# Altium schematic sheet 243-5xx_Pi-CAN-PWM.SchDoc: CAN Controller + Transceiver and Ctrl PWM
size Letter; ApprovedBy: k.cotton; Engineer: K.Cotton; Organization: Cegep Limoilou; Address1: 1300, 8e Avenue; Address2: Québec, QC; Address3: Canada; Address4: G1J 5L5; SheetNumber: 1; SheetTotal: 4
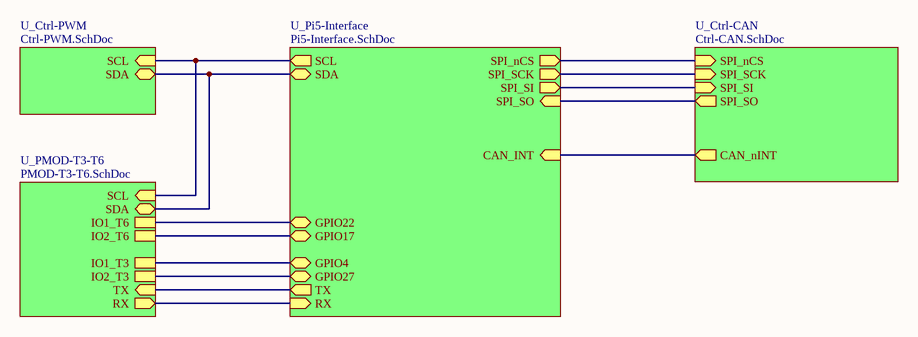
[diagram p0: 243-5xx_Pi-CAN-PWM.SchDoc]

## Sub-sheets
U_Ctrl-CAN = Ctrl-CAN.SchDoc: SPI_nCS (in), SPI_SCK (in), SPI_SI (in), SPI_SO (out), CAN_nINT (out)
U_Ctrl-PWM = Ctrl-PWM.SchDoc: SCL (in), SDA (bidir)
U_Pi5-Interface = Pi5-Interface.SchDoc: SPI_SI (out), SPI_nCS (out), SPI_SCK (out), SPI_SO (in), SCL (out), SDA (bidir), RX (in), TX (out), CAN_INT (in), GPIO4 (bidir), GPIO27 (bidir), GPIO22 (bidir), GPIO17 (bidir)
U_PMOD-T3-T6 = PMOD-T3-T6.SchDoc: RX (out), TX (in), SCL (in), SDA (bidir), IO1_T3, IO2_T3, IO1_T6, IO2_T6

## Nets
(unnamed): sheet U_Ctrl-CAN/SPI_nCS, sheet U_Pi5-Interface/SPI_nCS
(unnamed): sheet U_Ctrl-CAN/SPI_SCK, sheet U_Pi5-Interface/SPI_SCK
(unnamed): sheet U_Ctrl-CAN/SPI_SI, sheet U_Pi5-Interface/SPI_SI
(unnamed): sheet U_Ctrl-CAN/SPI_SO, sheet U_Pi5-Interface/SPI_SO
(unnamed): sheet U_Ctrl-CAN/CAN_nINT, sheet U_Pi5-Interface/CAN_INT
(unnamed): sheet U_Ctrl-PWM/SCL, sheet U_Pi5-Interface/SCL, sheet U_PMOD-T3-T6/SCL
(unnamed): sheet U_Ctrl-PWM/SDA, sheet U_Pi5-Interface/SDA, sheet U_PMOD-T3-T6/SDA
(unnamed): sheet U_Pi5-Interface/RX, sheet U_PMOD-T3-T6/RX
(unnamed): sheet U_Pi5-Interface/TX, sheet U_PMOD-T3-T6/TX
(unnamed): sheet U_Pi5-Interface/GPIO4, sheet U_PMOD-T3-T6/IO1_T3
(unnamed): sheet U_Pi5-Interface/GPIO27, sheet U_PMOD-T3-T6/IO2_T3
(unnamed): sheet U_Pi5-Interface/GPIO22, sheet U_PMOD-T3-T6/IO1_T6
(unnamed): sheet U_Pi5-Interface/GPIO17, sheet U_PMOD-T3-T6/IO2_T6

## Notes on the sheet
- Titre :
- Conception :
- Date :
- Approbation :
- Heure :
- Révision :
- Feuille
- de
- Fichier :